# EAGLE schematic wagband_chestpiece_pre_route (EAGLE 7.5.0)
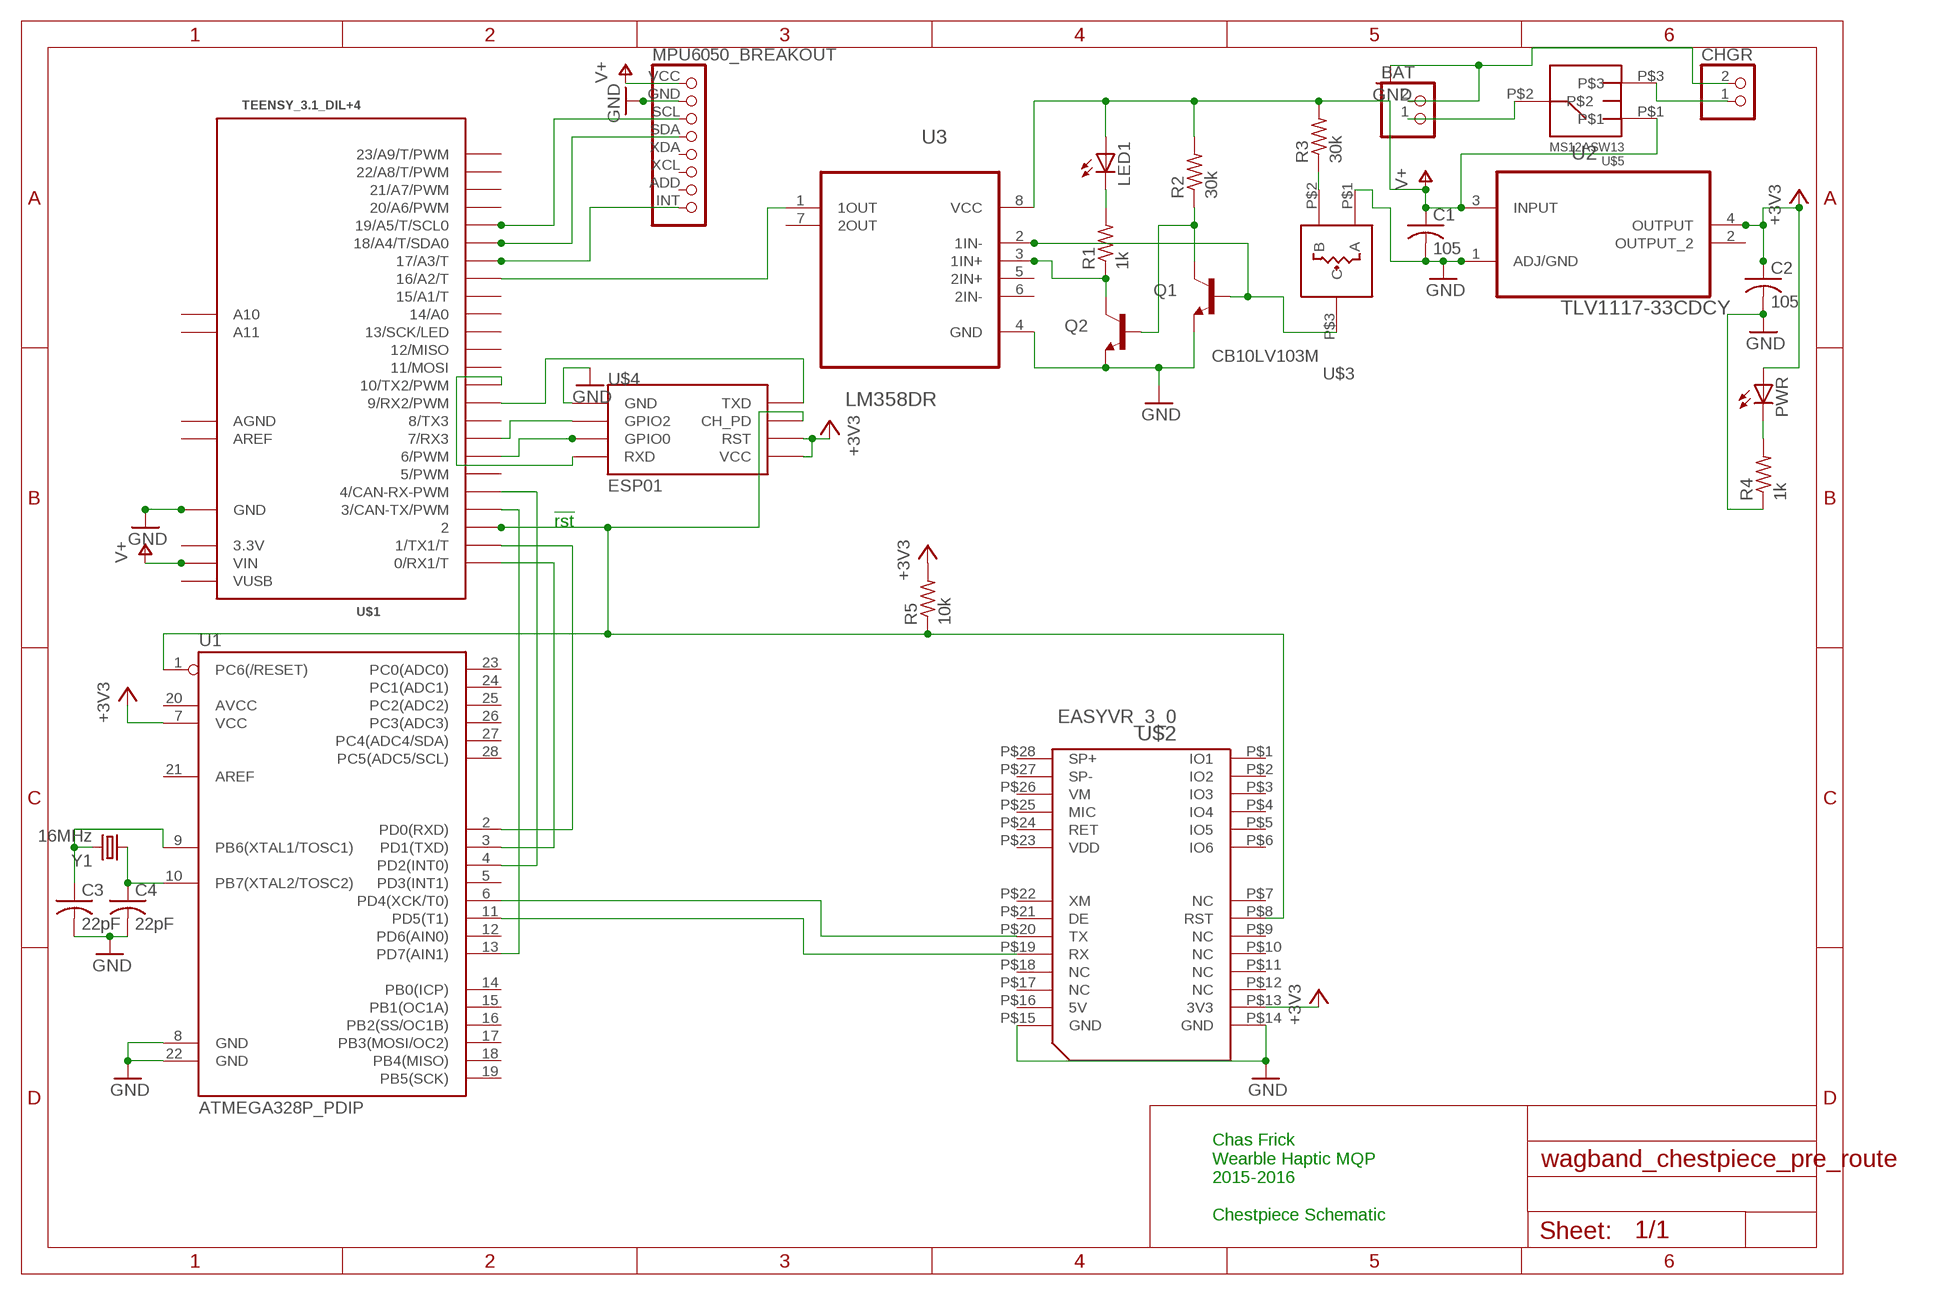
[diagram p0: schematic, sheet 1]

## Parts
BAT  JST_2PIN-THM-RA  [JST-PH-2-THM-RA]
C1  105  C-USC0805K  [C0805K]
C2  105  C-USC0805K  [C0805K]
C3  22pF  C-USC1206K  [C1206K]
C4  22pF  C-USC1206K  [C1206K]
CHGR  JST_2PIN-THM-RA  [JST-PH-2-THM-RA]
LED1  LED5MM  [LED5MM]
MPU6050_BREAKOUT  MPU6050_BREAKOUT  [MPU6050]
PWR  LED5MM  [LED5MM]
Q1  TRANSISTOR_NPNMMBT3904  [SOT-23]
Q2  TRANSISTOR_NPNMMBT3904  [SOT-23]
R1  1k  R-US_R1206  [R1206]
R2  30k  R-US_R1206  [R1206]
R3  30k  R-US_R1206  [R1206]
R4  1k  R-US_R1206  [R1206]
R5  10k  R-US_R1206  [R1206]
U1  ATMEGA328P_PDIP  [DIL28-3]
U2  TLV1117-33CDCY  [SOT230P700X180-4N]
U3  LM358DR  [SOIC127P600X175-8N]
U$1  TEENSY_3.1_DIL+4  [TEENSY3-DIL+4]
U$2  EASYVR_3_0  [EASYVR_3_0]
U$3  CB10LV103M  [CB10]
U$4  ESP01  [ESP01]
U$5  MS12ASW13  [SPDT]
Y1  16MHz  CRYSTALSMD  [HC49UP]

## Nets
!RST: R5.1 U1.1(PC6(/RESET)) U$1.2 U$2.P$8(RST) U$4.CH_PD
+3V3 [PWR]: C2.1 PWR.A R5.2 U1.7(VCC) U2.4(OUTPUT) U$2.P$13(3V3) U$4.RST U$4.VCC
GND: BAT.2 C1.2 C2.2 C3.2 C4.2 CHGR.2 MPU6050_BREAKOUT.GND Q1.2(E) Q2.2(E) R4.1 U1.8(GND) U1.22(GND) U2.1(ADJ/GND) U3.4(GND) U$1.GND U$2.P$14(GND) U$2.P$15(GND) U$3.P$1(A) U$4.GND
N$1: U1.4(PD2(INT0)) U$1.4(4/CAN-RX-PWM)
N$2: U$1.10(10/TX2/PWM) U$4.RX(RXD)
N$3: MPU6050_BREAKOUT.SDA U$1.18/A4(18/A4/T/SDA0)
N$4: Q1.1(B) U3.2(1IN-) U$3.P$3(C)
N$5: U1.11(PD5(T1)) U$2.P$19(RX)
N$6: U1.6(PD4(XCK/T0)) U$2.P$20(TX)
N$8: MPU6050_BREAKOUT.INT U$1.17/A3(17/A3/T)
N$9: Q1.3(C) Q2.1(B) R2.1
N$10: Q2.3(C) R1.1 U3.3(1IN+)
N$11: R3.1 U$3.P$2(B)
N$12: LED1.K(C) R1.2
N$13: U1.2(PD0(RXD)) U$1.1(1/TX1/T)
N$14: U3.1(1OUT) U$1.16/A2(16/A2/T)
N$15: PWR.K(C) R4.2
N$16: U1.13(PD7(AIN1)) U$1.3(3/CAN-TX/PWM)
N$17: MPU6050_BREAKOUT.SCL U$1.19/A5(19/A5/T/SCL0)
N$18: U$1.6(6/PWM) U$4.GPIO0
N$19: U$1.9(9/RX2/PWM) U$4.TX(TXD)
N$20: C3.1 U1.9(PB6(XTAL1/TOSC1)) Y1.2
N$21: C4.1 U1.10(PB7(XTAL2/TOSC2)) Y1.1
N$22: U1.3(PD1(TXD)) U$1.0(0/RX1/T)
N$23: BAT.1 U$5.P$2
N$24: U$1.7(7/RX3) U$4.GPIO2
N$25: CHGR.1 U$5.P$3
V+ [PWR]: C1.1 LED1.A MPU6050_BREAKOUT.VCC R2.2 R3.2 U2.3(INPUT) U3.8(VCC) U$1.VIN U$5.P$1
Unconnected: MPU6050_BREAKOUT.ADD MPU6050_BREAKOUT.XCL MPU6050_BREAKOUT.XDA U1.5(PD3(INT1)) U1.12(PD6(AIN0)) U1.14(PB0(ICP)) U1.15(PB1(OC1A)) U1.16(PB2(SS/OC1B)) U1.17(PB3(MOSI/OC2)) U1.18(PB4(MISO)) U1.19(PB5(SCK)) U1.20(AVCC) U1.21(AREF) U1.23(PC0(ADC0)) U1.24(PC1(ADC1)) U1.25(PC2(ADC2)) U1.26(PC3(ADC3)) U1.27(PC4(ADC4/SDA)) U1.28(PC5(ADC5/SCL)) U2.2(OUTPUT_2) U3.5(2IN+) U3.6(2IN-) U3.7(2OUT) U$1.5(5/PWM) U$1.8(8/TX3) U$1.11(11/MOSI) U$1.12(12/MISO) U$1.13(13/SCK/LED) U$1.14/A0 U$1.15/A1(15/A1/T) U$1.20/A6(20/A6/PWM) U$1.21/A7(21/A7/PWM) U$1.22/A8(22/A8/T/PWM) U$1.23/A9(23/A9/T/PWM) U$1.A10 U$1.A11 U$2.P$1(IO1) U$2.P$2(IO2) U$2.P$3(IO3) U$2.P$4(IO4) U$2.P$5(IO5) U$2.P$6(IO6) U$2.P$7(NC) U$2.P$9(NC) U$2.P$10(NC) U$2.P$11(NC) U$2.P$12(NC) U$2.P$17(NC) U$2.P$18(NC) U$2.P$21(DE) U$2.P$22(XM) U$2.P$24(RET) U$2.P$25(MIC) U$2.P$26(VM) U$2.P$27(SP-) U$2.P$28(SP+)

## Notes on the sheet
- !rst
- Chas Frick
  Wearble Haptic MQP
  2015-2016
  
  Chestpiece Schematic

## Power pins joined to a net without a drawn wire
3.3V: U$1.3.3V
5V: U$2.P$16(5V)
AGND: U$1.AGND
AREF: U$1.AREF
VDD: U$2.P$23(VDD)
VUSB: U$1.VUSB

## Library data of the parts
BAT CHGR = adafruit:JST_2PIN: JST 2-Pin Connectors of various flavors SMT-RA (S2B-PH-SM4) 4UConnector #17311 SMT (B2B-PH-SM4) THM-RA (S2B-PH) THM (B2B-PH)
C1 C2 = resistor:C-US: CAPACITOR, American symbol
C3 C4 = rcl:C-US: CAPACITOR, American symbol
LED1 PWR = led:LED: LED OSRAM: - CHIPLED LG R971, LG N971, LY N971, LG Q971, LY Q971, LO R971, LY R971 LH N974, LH R974 LS Q976, LO Q976, LY Q976 LO Q996 - Hyper CHIPLED LW Q18S LB Q993, LB Q99A, LB R99A - SideLED LS A670, LO A670, LY A670, LG A670, LP A670 LB A673, LV A673, LT A673, LW A673 LH A674 LY A675 LS A676, LA A676, LO A676, LY A676, LW A676 LS A679, LY A679, LG A679 - Hyper Micro SIDELED® LS Y876, LA Y876, LO Y876, LY Y876 LT Y87S - SmartLED LW L88C, LW L88S LB L89C, LB L89S, LG L890 LS L89K, LO L89K, LY L89K LS L896, LA L896, LO L896, LY L896 - TOPLED LS T670, LO T670, LY T670, LG T670, LP T670 LSG T670, LSP T670, LSY T670, LOP T670, LYG T670 LG T671, LOG T671, LSG T671 LB T673, LV T673, LT T673, LW T673 LH T674 LS T676, LA T676, LO T676, LY T676, LB T676, LH T676, LSB T676, LW T676 LB T67C, LV T67C, LT T67C, LS T67K, LO T67K, LY T67K, LW E67C LS E67B, LA E67B, LO E67B, LY E67B, LB E67C, LV E67C, LT E67C LW T67C LS T679, LY T679, LG T679 LS T770, LO T770, LY T770, LG T770, LP T770 LB T773, LV T773, LT T773, LW T773 LH T774 LS E675, LA E675, LY E675, LS T675 LS T776, LA T776, LO T776, LY T776, LB T776 LHGB T686 LT T68C, LB T68C - Hyper Mini TOPLED® LB M676 - Mini TOPLED Santana® LG M470 LS M47K, LO M47K, LY M47K Source: http://www.osram.convergy.de LUXEON: - LUMILED® LXK2-PW12-R00, LXK2-PW12-S00, LXK2-PW14-U00, LXK2-PW14-V00 LXK2-PM12-R00, LXK2-PM12-S00, LXK2-PM14-U00 LXK2-PE12-Q00, LXK2-PE12-R00, LXK2-PE12-S00, LXK2-PE14-T00, LXK2-PE14-U00 LXK2-PB12-K00, LXK2-PB12-L00, LXK2-PB12-M00, LXK2-PB14-N00, LXK2-PB14-P00, LXK2-PB14-Q00 LXK2-PR12-L00, LXK2-PR12-M00, LXK2-PR14-Q00, LXK2-PR14-R00 LXK2-PD12-Q00, LXK2-PD12-R00, LXK2-PD12-S00 LXK2-PH12-R00, LXK2-PH12-S00 LXK2-PL12-P00, LXK2-PL12-Q00, LXK2-PL12-R00 Source: www.luxeon.com KINGBRIGHT: KA-3528ASYC Source: www.kingbright.com
MPU6050_BREAKOUT = mqp_custom_parts:MPU6050_BREAKOUT: PIN HEADER
Q1 Q2 = mqp_custom_parts:TRANSISTOR_NPN: MMBT3904LT1G Made for the MMBT3904LT1G from ON Semiconductor See here: http://www.newark.com/on-semiconductor/mmbt3904lt1g/bipolar-transistor-npn-40v-sot/dp/83H7337 NPN BJT with 200mA capacity and 40V Vce breakdown
R1-R5 = resistor:R-US_: RESISTOR, American symbol
U1 = SparkFun-DigitalIC:ATMEGA328P_PDIP: uC used in the Arduino 32kb flash, 1k EEPROM, 2k SRAM This is the through-hole version of this chip.
U2 = Texas Instruments_By_element14_Batch_1:TLV1117-33CDCY: V REG, LDO, 3.3V, 0.8A; MPN: TLV1117-33CDCY; OC_FARNELL: 1494942; OC_NEWARK: 67K8520; PACKAGE: SOT-223-3; SUPPLIER: TEXAS INSTRUMENTS
U3 = Texas Instruments_By_element14_Batch_1:LM358DR: OPERATIONAL AMPLIFIERS; MPN: LM358DR; OC_FARNELL: 1831865; OC_NEWARK: 34K7599; PACKAGE: SOIC-8; SUPPLIER: Texas Instruments
U$1 = Teensy_3_and_LC_Series_Boards_v1.1:TEENSY_3.1_DIL+4: Teensy 3.1 and 3.2 in a DIL package with the inner 4 pins
U$2 = mqp_custom_parts:EASYVR_3_0
U$3 = mqp_custom_parts:CB10LV103M
U$4 = mqp_custom_parts:ESP01: ESP8266 Wifi module 01
U$5 = mqp_custom_parts:MS12ASW13
Y1 = SparkFun-FreqCtrl:CRYSTAL: Various standard crystals. Proven footprints.

## Net classes
1 GND: width 0.406 mm
2 PWR: width 0.406 mm